# Altium project CoaxPress_SFP.PrjPcb
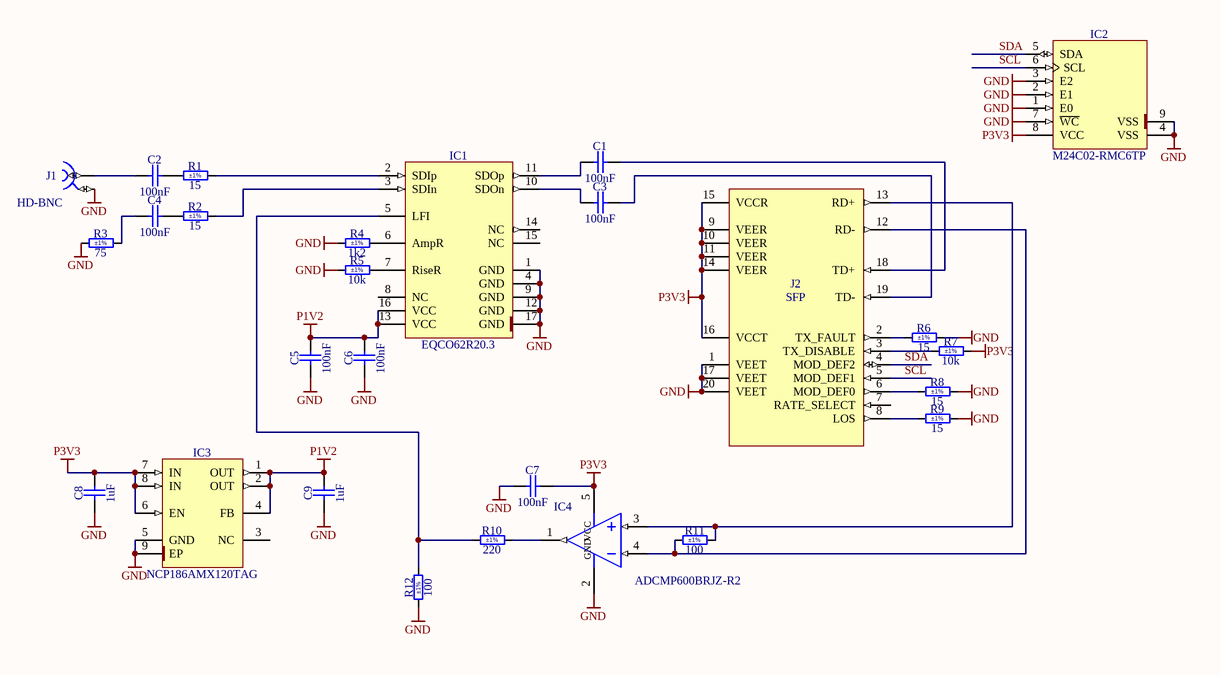
[diagram p0: CoaxPress_SFP.SchDoc]
1 sheet, 27 parts. Net scope: global (net labels, ports and power ports of the same name join across sheets).
Board file: CoaxPress_SFP.PcbDoc

## Sheet CoaxPress_SFP.SchDoc
size A4; SheetNumber: 1; SheetTotal: 1

### Parts
C1  100nF  [CAPC1005X55N]
C2  100nF  [CAPC1005X55N]
C3  100nF  [CAPC1005X55N]
C4  100nF  [CAPC1005X55N]
C5  100nF  [CAPC1005X55N]
C6  100nF  [CAPC1005X55N]
C7  100nF  [CAPC1005X55N]
C8  1uF  [CAPC1005X55N]
C9  1uF  [CAPC1005X55N]
IC1  EQCO62R20.3  [QFN65P400X400X95-17N-S215]
IC2  M24C02-RMC6TP  [SON50P300X200X60-9N-S160]
IC3  NCP186AMX120TAG  [ONSEMI_CASE 711AS]
IC4  ADCMP600BRJZ-R2  [SOT95P280X145-5N]
J1  HD-BNC  [AMPHENOL_34-1030-12G]
J2  SFP  [SFP_PCB_EDGE]
R1  15  Tolerance: ±1%  [RESC1005X40N]
R2  15  Tolerance: ±1%  [RESC1005X40N]
R3  75  Tolerance: ±1%  [RESC1005X40N]
R4  1k2  Tolerance: ±1%  [RESC1005X40N]
R5  10k  Tolerance: ±1%  [RESC1005X40N]
R6  15  Tolerance: ±1%  [RESC1005X40N]
R7  10k  Tolerance: ±1%  [RESC1005X40N]
R8  15  Tolerance: ±1%  [RESC1005X40N]
R9  15  Tolerance: ±1%  [RESC1005X40N]
R10  220  Tolerance: ±1%  [RESC1005X40N]
R11  100  Tolerance: ±1%  [RESC1005X40N]
R12  100  Tolerance: ±1%  [RESC1005X40N]

### Nets
GND: C5.1 C6.1 C7.1 C8.1 C9.1 IC1.1(GND) IC1.4(GND) IC1.9(GND) IC1.12(GND) IC1.17(GND) IC2.1(E0) IC2.2(E1) IC2.3(E2) IC2.4(VSS) IC2.7(~{WC}) IC2.9(VSS) IC3.5(GND) IC3.9(EP) IC4.2(GND) J1.2 J2.1(VEET) J2.17(VEET) J2.20(VEET) R3.1 R4.1 R5.1 R6.2 R8.2 R9.2 R12.1
P1V2: C5.2 C6.2 C9.2 IC1.13(VCC) IC1.16(VCC) IC3.1(OUT) IC3.2(OUT) IC3.4(FB)
P3V3: C7.2 C8.2 IC2.8(VCC) IC3.6(EN) IC3.7(IN) IC3.8(IN) IC4.5(VCC) J2.9(VEER) J2.10(VEER) J2.11(VEER) J2.14(VEER) J2.15(VCCR) J2.16(VCCT) R7.2
SCL: IC2.6(SCL) J2.5(MOD_DEF1)
SDA: IC2.5(SDA) J2.4(MOD_DEF2)
NetC1_1: C1.1 IC1.11(SDOp)
NetC1_2: C1.2 J2.18(TD+)
NetC2_1: C2.1 J1.1
NetC2_2: C2.2 R1.1
NetC3_1: C3.1 IC1.10(SDOn)
NetC3_2: C3.2 J2.19(TD-)
NetC4_1: C4.1 R3.2
NetC4_2: C4.2 R2.1
NetIC1_2: IC1.2(SDIp) R1.2
NetIC1_3: IC1.3(SDIn) R2.2
NetIC1_5: IC1.5(LFI) R10.1 R12.2
NetIC1_6: IC1.6(AmpR) R4.2
NetIC1_7: IC1.7(RiseR) R5.2
NetIC4_1: IC4.1(q) R10.2
NetIC4_3: IC4.3(VP) J2.13(RD+) R11.2
NetIC4_4: IC4.4(VN) J2.12(RD-) R11.1
NetJ2_2: J2.2(TX_FAULT) R6.1
NetJ2_3: J2.3(TX_DISABLE) R7.1
NetJ2_6: J2.6(MOD_DEF0) R8.1
NetJ2_8: J2.8(LOS) R9.1

Not connected (* = marked no-connect by the designer): IC1 8(NC) 14(NC) 15(NC); IC3 3(NC); J2 7(RATE_SELECT)

### Library data of the parts
C1-C7 = CC0402_100NF_16V_10%_X5R: Non-polarised capacitor; Part Description: SMD Multilayer Chip Ceramic Capacitor; Manufacturer: GENERIC; Manufacturer1 Part Number: GRM155R61C104KA88D; Voltage: 16V; TC: X5R; Tolerance: ±10%; Part Number: CC0402_100NF_16V_10%_X5R; Component Kind: Standard; Component Type: Standard; Pin Count: 2; Value: 100nF; Status: None; Manufacturer Part Number: CC0402_100NF_16V_10%_X5R; Case: 0402; Mounted: Yes; Socket: No; SMD: Yes; Sense: No; Manufacturer1 Example: MURATA; Manufacturer1 ComponentHeight: 0.55mm; HelpURL: \\cern.ch\dfs\Applications\Altium\Datasheets\CC0402_X5R_MURATA_GRM.pdf; Author: CERN DEM JLC; CreateDate: 10.12.2013; LatestRevisionDate: 10.12.2013
C8 C9 = CC0402_1UF_16V_10%_X5R: Non-polarised capacitor; Part Description: SMD Multilayer Chip Ceramic Capacitor; Manufacturer: GENERIC; Manufacturer1 Part Number: C1005X5R1C105KT; Voltage: 16V; TC: X5R; Tolerance: ±10%; Part Number: CC0402_1UF_16V_10%_X5R; Component Kind: Standard; Component Type: Standard; Pin Count: 2; Value: 1uF; Status: Preferred; Manufacturer Part Number: CC0402_1UF_16V_10%_X5R; Case: 0402; Mounted: Yes; Socket: No; SMD: Yes; Sense: No; Manufacturer1 Example: TDK; Manufacturer1 ComponentHeight: 0.55mm; HelpURL: \\cern.ch\dfs\Applications\Altium\Datasheets\CC0402_X5R_TDK_C.pdf; Author: CERN DEM JLC; CreateDate: 25.10.2012; LatestRevisionDate: 25.10.2012
IC1 = EQCO62R20.3: 6.25Gbps Asymmetric Coax Equalizer; Manufacturer: MICROCHIP TECHNOLOGY; PressFit: No; Bonding: No; Part Number: EQCO62R20.3; Component Kind: Standard; Component Type: Standard; Device: EQCO62R20.3; PackageDescription: QFN, 0.65mm Pitch, Square; 16 Pin, 4.00mm L X 4.00mm W X 0.95mm H body (w/Thermal Tab 2.15 X 2.15mm), IPC Medium Density; Part Description: 6.25Gbps Asymmetric Coax Equalizer; Manufacturer Part Number: EQCO62R20.3; Pin Count: 17; Case: QFN16; Mounted: Yes; Socket: No; SMD: Yes; Sense: No; ComponentHeight: 0.95mm; Author: CERN DEM JLC; HelpURL: \\cern.ch\dfs\Applications\Altium\Datasheets\EQCO62R20.3.pdf; CreateDate: 11.07.2018; LatestRevisionDate: 11.07.2018
IC2 = M24C02-RMC6TP: 2-Kbit (256 x 8bit) Serial I2C Bus EEPROM; Manufacturer: ST MICROELECTRONICS; PressFit: No; Bonding: No; Part Number: M24C02-RMC6TP; Component Kind: Standard; Component Type: Standard; Device: M24C02-RMC6TP; PackageDescription: SON (DFN), 0.50mm pitch, 8 pin, 2mm X 3mm X 0.8mm H body (w/thermal tab 1.60 X 1.60mm),  IPC Medium Density; Part Description: 2-Kbit (256 x 8bit) Serial I2C Bus EEPROM; Manufacturer Part Number: M24C02-RMC6TP; Pin Count: 9; Case: SON8; Mounted: Yes; Socket: No; SMD: Yes; Sense: No; ComponentHeight: 0.6mm; HelpURL: \\cern.ch\dfs\Applications\Altium\Datasheets\M24C02-RMC6TP.pdf; Author: CERN DEM MR; CreateDate: 12.12.2019; LatestRevisionDate: 12.12.2019
IC3 = NCP186AMX120TAG: 1A, LDO Regulator - Fast Transient Response Low Voltage; Part Description: 1.2V, 1A, LDO Regulator - Fast Transient Response Low Voltage; Manufacturer: ON SEMICONDUCTOR; PressFit: No; Bonding: No; Part Number: NCP186AMX120TAG; Component Kind: Standard; Component Type: Standard; Device: NCP186AMX120TAG; PackageDescription: PSON, ONSEMI Case 711AS, 0.40mm Pitch, 8 Pin, 1.20mm W X 1.60mm L X 0.45mm H body (w/Pullback Leads, Thermal Tab 0.30 X 1.30mm); Manufacturer Part Number: NCP186AMX120TA; Pin Count: 9; Case: SON8; Mounted: Yes; Socket: No; SMD: Yes; Sense: No; ComponentHeight: 0.45mm; HelpURL: \\cern.ch\dfs\Applications\Altium\Datasheets\NCP186AMX120TAG.pdf; Author: CERN DEM BC; CreateDate: 23.03.2020; LatestRevisionDate: 24.05.2022
IC4 = ADCMP600BRJZ-R2: Rail-to-Rail, Very Fast, 2.5 V to 5.5 V Single-Supply TTL/CMOS Comparator; Manufacturer: ANALOG DEVICES; PressFit: No; Bonding: No; Part Number: ADCMP600BRJZ-R2; Component Kind: Standard; Component Type: Standard; Device: ADCMP600BRJZ-R2; PackageDescription: SOT, 0.95mm Pitch; 5 Pin, 1.60mm W X 2.90mm L X 1.45mm H body, IPC Medium Density; Part Description: Rail-to-Rail, Very Fast, 2.5 V to 5.5 V Single-Supply TTL/CMOS Comparator; Manufacturer Part Number: ADCMP600BRJ; Pin Count: 5; Case: SOT23-5; Mounted: Yes; Socket: No; SMD: Yes; Sense: No; ComponentHeight: 1.45mm; Author: CERN DEM JLC; HelpURL: \\cern.ch\dfs\Applications\Altium\Datasheets\ADCMP600BRJZ-R2.pdf; CreateDate: 25.04.2012; LatestRevisionDate: 31.03.2022
J1 = AMPHENOL_34-1030-12G: Part Description: 75 Ohms HD-BNC Right Angle PCB Receptacle (Jack); Manufacturer: AMPHENOL-RF; PressFit: No; Part Number: AMPHENOL_34-1030-12G; Component Kind: Standard; Component Type: Standard; Pin Count: 2; Family: HD-BNC; Mounted: Yes; Socket: No; SMD: No; Sense: No; Status: None; Manufacturer Part Number: 34-1030-12G; ComponentHeight: 8.5mm; HelpURL: \\cern.ch\dfs\Applications\Altium\Datasheets\AMPHENOL_34-1030-12G.pdf; Author: CERN DEM JLC; CreateDate: 21.02.2017; LatestRevisionDate: 21.02.2017
J2 = SFP_PCB_EDGE: 20 Position SFP  Connector (Small Form-factor Pluggable); Part Description: 20 contacts SFP PCB Edge Finger Connector; Mounted: No; PressFit: No; Part Number: SFP_PCB_EDGE; Component Kind: Standard (No BOM); Component Type: Standard (No BOM); Pin Count: 20; Family: SFP; Socket: No; SMD: No; Sense: No; Status: None; ComponentHeight: 0mm; HelpURL: \\cern.ch\dfs\Applications\Altium\Datasheets\SFP_PCB_EDGE.pdf; Author: CERN DEM JLC; CreateDate: 05.07.2018; LatestRevisionDate: 05.07.2018
R1 R2 R6 R8 R9 = R0402_15R_1%_0.0625W_100PPM: Resistor - 1%; Part Description: General Purpose Thick Film Chip Resistor; Manufacturer: GENERIC; Manufacturer1 Part Number: 232270671509L; TC: ±100ppm/°C; PressFit: No; Part Number: R0402_15R_1%_0.0625W_100PPM; Component Kind: Standard; Component Type: Standard; Pin Count: 2; Value: 15; Status: Not Recommended; Power: 0.0625W; Manufacturer Part Number: R0402_15R_1%_0.0625W_100PPM; Case: 0402; Mounted: Yes; Sense: No; Socket: No; SMD: Yes; Manufacturer1 Example: YAGEO PHYCOMP; Manufacturer1 ComponentHeight: 0.4mm; HelpURL: \\cern.ch\dfs\Applications\Altium\Datasheets\R0402_Phycomp_RC0402.pdf; Author: CERN DEM JLC; CreateDate: 03.12.2007; LatestRevisionDate: 17.10.2012
R3 = R0402_75R_1%_0.0625W_100PPM: Resistor - 1%; Part Description: General Purpose Thick Film Chip Resistor; Manufacturer: GENERIC; Manufacturer1 Part Number: 232270677509L; TC: ±100ppm/°C; PressFit: No; Part Number: R0402_75R_1%_0.0625W_100PPM; Component Kind: Standard; Component Type: Standard; Pin Count: 2; Value: 75; Status: Not Recommended; Power: 0.0625W; Manufacturer Part Number: R0402_75R_1%_0.0625W_100PPM; Case: 0402; Mounted: Yes; Sense: No; Socket: No; SMD: Yes; Manufacturer1 Example: YAGEO PHYCOMP; Manufacturer1 ComponentHeight: 0.4mm; HelpURL: \\cern.ch\dfs\Applications\Altium\Datasheets\R0402_Phycomp_RC0402.pdf; Author: CERN DEM JLC; CreateDate: 03.12.2007; LatestRevisionDate: 17.10.2012
R4 = R0402_1K2_1%_0.0625W_100PPM: Resistor - 1%; Part Description: General Purpose Thick Film Chip Resistor; Manufacturer: GENERIC; Manufacturer1 Part Number: 232270671202L; TC: ±100ppm/°C; PressFit: No; Part Number: R0402_1K2_1%_0.0625W_100PPM; Component Kind: Standard; Component Type: Standard; Pin Count: 2; Value: 1k2; Status: Not Recommended; Power: 0.0625W; Manufacturer Part Number: R0402_1K2_1%_0.0625W_100PPM; Case: 0402; Mounted: Yes; Sense: No; Socket: No; SMD: Yes; Manufacturer1 Example: YAGEO PHYCOMP; Manufacturer1 ComponentHeight: 0.4mm; HelpURL: \\cern.ch\dfs\Applications\Altium\Datasheets\R0402_Phycomp_RC0402.pdf; Author: CERN DEM JLC; CreateDate: 03.12.2007; LatestRevisionDate: 17.10.2012
R5 R7 = R0402_10K_1%_0.0625W_100PPM: Resistor - 1%; Part Description: General Purpose Thick Film Chip Resistor; Manufacturer: GENERIC; Manufacturer1 Part Number: 232270671003L; TC: ±100ppm/°C; PressFit: No; Part Number: R0402_10K_1%_0.0625W_100PPM; Component Kind: Standard; Component Type: Standard; Pin Count: 2; Value: 10k; Status: Not Recommended; Power: 0.0625W; Manufacturer Part Number: R0402_10K_1%_0.0625W_100PPM; Case: 0402; Mounted: Yes; Sense: No; Socket: No; SMD: Yes; Manufacturer1 Example: YAGEO PHYCOMP; Manufacturer1 ComponentHeight: 0.4mm; HelpURL: \\cern.ch\dfs\Applications\Altium\Datasheets\R0402_Phycomp_RC0402.pdf; Author: CERN DEM JLC; CreateDate: 03.12.2007; LatestRevisionDate: 17.10.2012
R10 = R0402_220R_1%_0.0625W_100PPM: Resistor - 1%; Part Description: General Purpose Thick Film Chip Resistor; Manufacturer: GENERIC; Manufacturer1 Part Number: 232270672201L; TC: ±100ppm/°C; PressFit: No; Part Number: R0402_220R_1%_0.0625W_100PPM; Component Kind: Standard; Component Type: Standard; Pin Count: 2; Value: 220; Status: Not Recommended; Power: 0.0625W; Manufacturer Part Number: R0402_220R_1%_0.0625W_100PPM; Case: 0402; Mounted: Yes; Sense: No; Socket: No; SMD: Yes; Manufacturer1 Example: YAGEO PHYCOMP; Manufacturer1 ComponentHeight: 0.4mm; HelpURL: \\cern.ch\dfs\Applications\Altium\Datasheets\R0402_Phycomp_RC0402.pdf; Author: CERN DEM JLC; CreateDate: 03.12.2007; LatestRevisionDate: 17.10.2012
R11 R12 = R0402_100R_1%_0.1W_100PPM: Resistor - 1%; Part Description: General Purpose Thick Film Chip Resistor; Manufacturer: GENERIC; Manufacturer Part Number: R0402_100R_1%_0.1W_100PPM_50V; Manufacturer1 Part Number: ERJ2RKF1000X; Power: 0.1W; TC: ±100ppm/°C; Voltage: 50V; PressFit: No; Part Number: R0402_100R_1%_0.1W_100PPM; Component Kind: Standard; Component Type: Standard; Pin Count: 2; Value: 100; Status: Not Recommended; Case: 0402; Mounted: Yes; Sense: No; Socket: No; SMD: Yes; Manufacturer1 Example: PANASONIC; Manufacturer1 ComponentHeight: 0.4mm; HelpURL: \\cern.ch\dfs\Applications\Altium\Datasheets\R0402_PANASONIC_ERJ2RK.pdf; Author: CERN DEM JLC; CreateDate: 12.12.2013; LatestRevisionDate: 03.03.2015